# EAGLE design Rangkaian 3 (EAGLE 9.3.1)
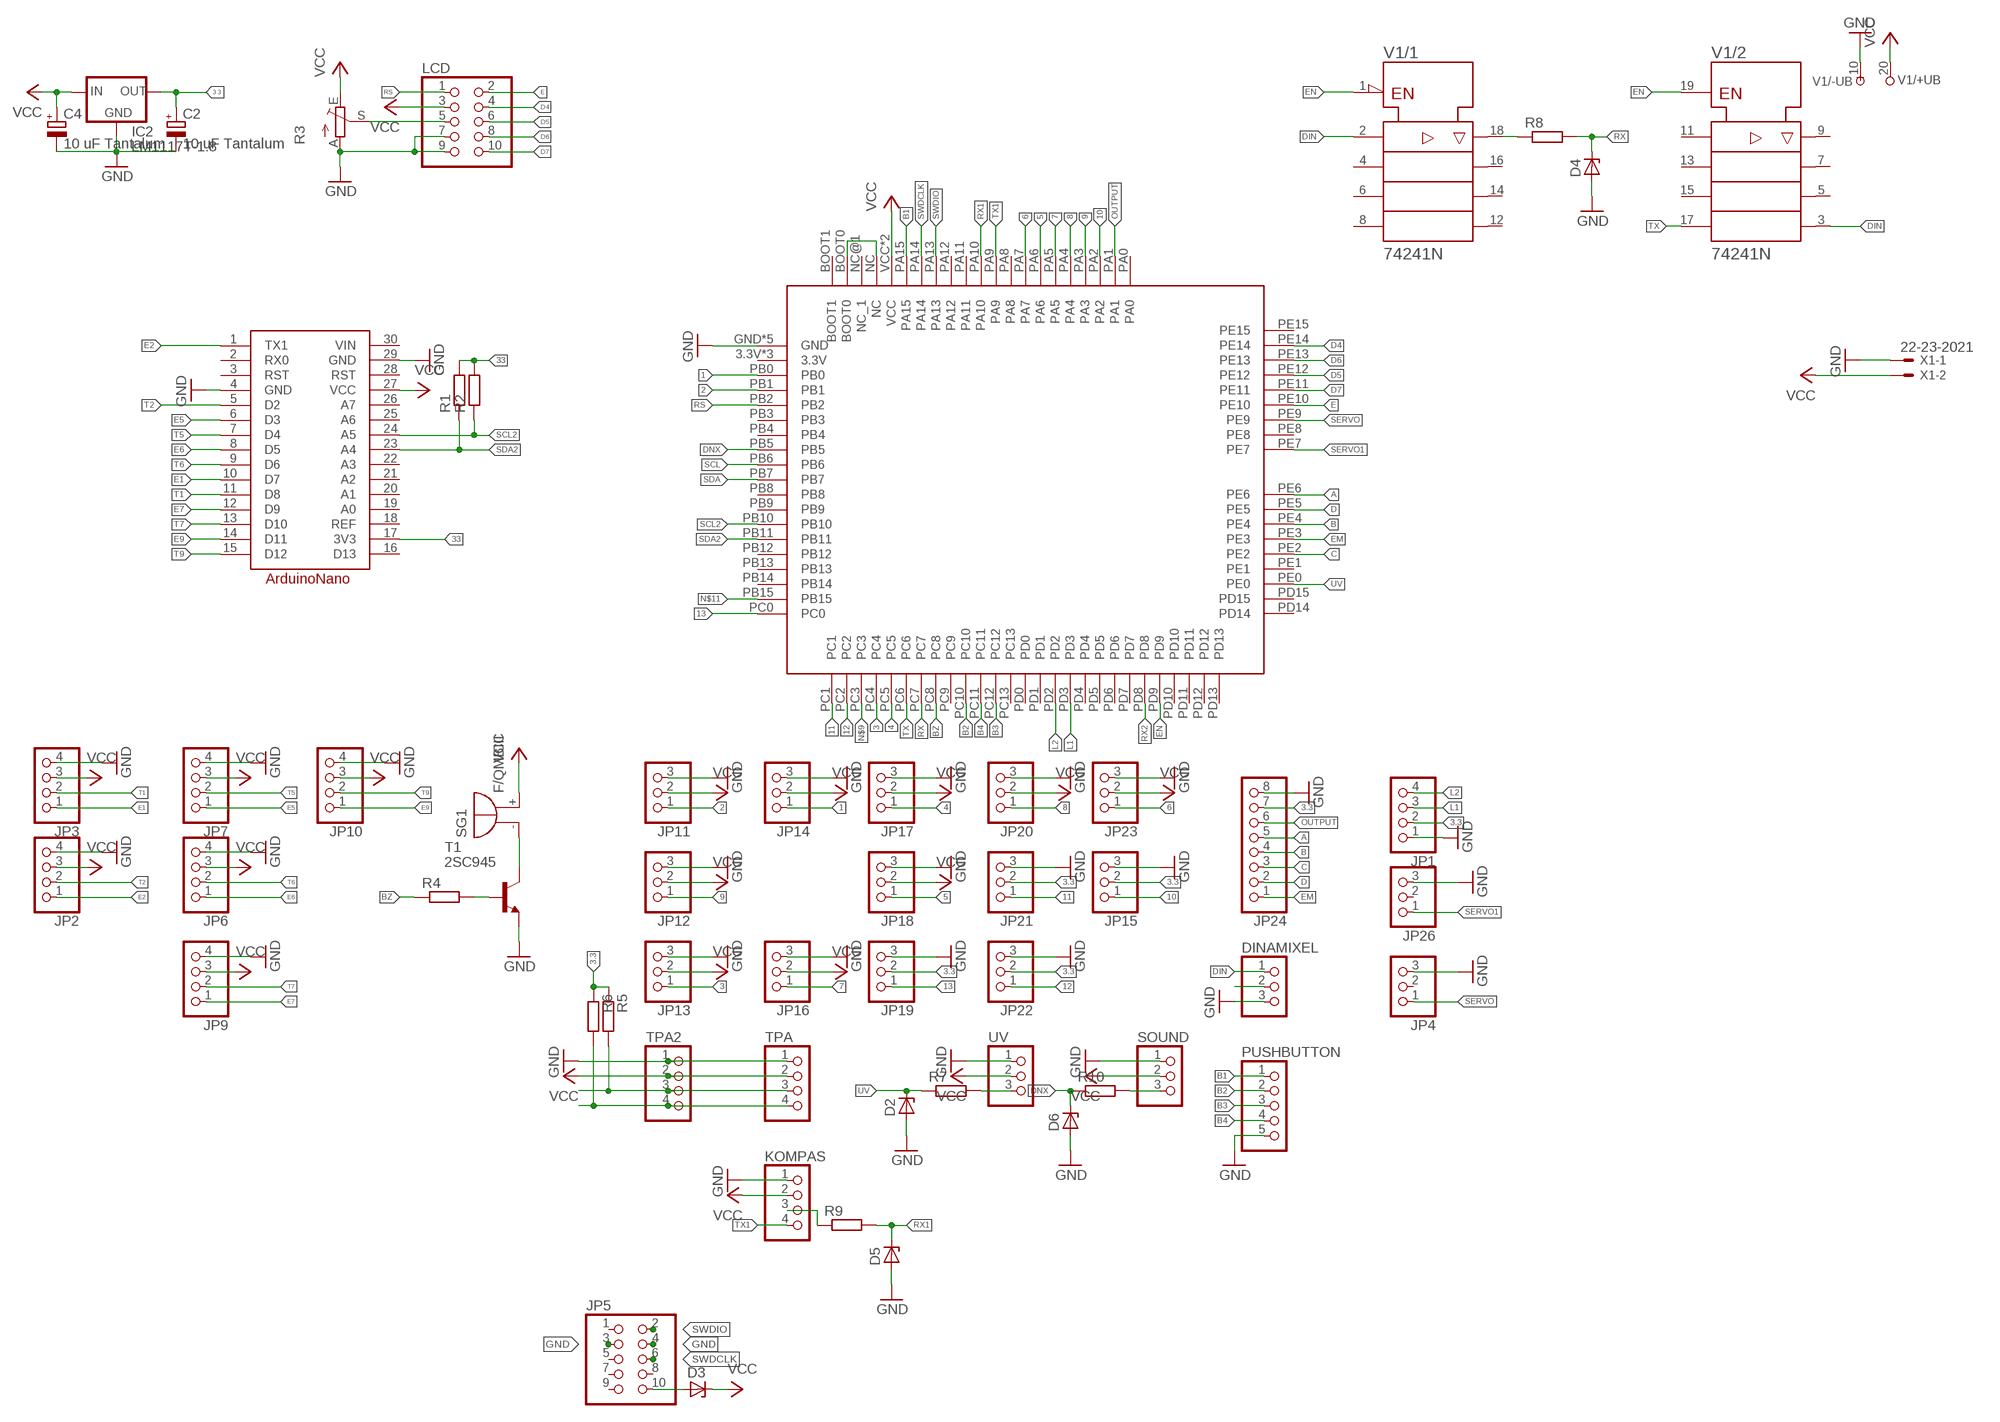
[diagram p0: schematic, sheet 1]

## Parts
A1  ARDUINONANO  [ARDUINONANO]
C2  10 uF Tantalum  CPOL-EUE2.5-5  [E2,5-5]
C4  10 uF Tantalum  CPOL-EUE2.5-5  [E2,5-5]
D2  ZENER-DIODEDO34-7  [DO34Z7]
D3  ZENER-DIODEDO34-7  [DO34Z7]
D4  ZENER-DIODEDO34-7  [DO34Z7]
D5  ZENER-DIODEDO34-7  [DO34Z7]
D6  ZENER-DIODEDO34-7  [DO34Z7]
DINAMIXEL  PINHD-1X3  [1X03]
IC2  LM1117T-1.8  [TO220]
JP1  PINHD-1X4  [1X04]
JP2  PINHD-1X4  [1X04]
JP3  PINHD-1X4  [1X04]
JP4  PINHD-1X3  [1X03]
JP5  PINHD-2X5  [2X05]
JP6  PINHD-1X4  [1X04]
JP7  PINHD-1X4  [1X04]
JP9  PINHD-1X4  [1X04]
JP10  PINHD-1X4  [1X04]
JP11  PINHD-1X3  [1X03]
JP12  PINHD-1X3  [1X03]
JP13  PINHD-1X3  [1X03]
JP14  PINHD-1X3  [1X03]
JP15  PINHD-1X3  [1X03]
JP16  PINHD-1X3  [1X03]
JP17  PINHD-1X3  [1X03]
JP18  PINHD-1X3  [1X03]
JP19  PINHD-1X3  [1X03]
JP20  PINHD-1X3  [1X03]
JP21  PINHD-1X3  [1X03]
JP22  PINHD-1X3  [1X03]
JP23  PINHD-1X3  [1X03]
JP24  PINHD-1X8  [1X08]
JP26  PINHD-1X3  [1X03]
KOMPAS  PINHD-1X4  [1X04]
LCD  PINHD-2X5  [2X05]
PUSHBUTTON  PINHD-1X5  [1X05]
R1  R-EU_0204/7  [0204/7]
R2  R-EU_0204/7  [0204/7]
R3  TRIM_EU-CA6V  [CA6V]
R4  R-EU_0204/7  [0204/7]
R5  R-EU_0204/7  [0204/7]
R6  R-EU_0204/7  [0204/7]
R7  R-EU_0204/7  [0204/7]
R8  R-EU_0204/7  [0204/7]
R9  R-EU_0204/7  [0204/7]
R10  R-EU_0204/7  [0204/7]
SG1  F/QMBIII  [F/QMBIII]
SOUND  PINHD-1X3  [1X03]
T1  2SC945  [TO92-ECB]
TPA  PINHD-1X4  [1X04]
TPA2  PINHD-1X4  [1X04]
U$1  STM32F4  [STM32F4]
UV  PINHD-1X3  [1X03]
V1  74241N  [DIL20]
X1  22-23-2021  [22-23-2021]

## Nets
1: JP14.1 U$1.PB0
2: JP11.1 U$1.PB1
3: JP13.1 U$1.PC4
3.3: C2.+ IC2.2(OUT) JP1.2 JP15.2 JP19.2 JP21.2 JP22.2 JP24.7 R5.1 R6.1
4: JP17.1 U$1.PC5
5: JP18.1 U$1.PA6
6: JP23.1 U$1.PA7
7: JP16.1 U$1.PA5
8: JP20.1 U$1.PA4
9: JP12.1 U$1.PA3
10: JP15.1 U$1.PA2
11: JP21.1 U$1.PC1
12: JP22.1 U$1.PC2
13: JP19.1 U$1.PC0
33: A1.17(3V3) R1.2 R2.2
A: JP24.5 U$1.PE6
B: JP24.4 U$1.PE4
B1: PUSHBUTTON.1 U$1.PA15
B2: PUSHBUTTON.2 U$1.PC10
B3: PUSHBUTTON.3 U$1.PC12
B4: PUSHBUTTON.4 U$1.PC11
BZ: R4.1 U$1.PC8
C: JP24.3 U$1.PE2
D: JP24.2 U$1.PE5
D4: LCD.4 U$1.PE14
D5: LCD.6 U$1.PE12
D6: LCD.8 U$1.PE13
D7: LCD.10 U$1.PE11
DIN: DINAMIXEL.1 V1.2(/1:A1) V1.3(/2:Y4)
DNX: D6.C R10.1 U$1.PB5
E: LCD.2 U$1.PE10
E1: A1.10(D7) JP3.1
E2: A1.1(TX1) JP2.1
E5: A1.6(D3) JP7.1
E6: A1.8(D5) JP6.1
E7: A1.12(D9) JP9.1
E9: A1.14(D11) JP10.1
EM: JP24.1 U$1.PE3
EN: U$1.PD9 V1.1(/1:!G) V1.19(/2:G)
GND: A1.4(GND) A1.29(GND) C2.- C4.- D2.A D4.A D5.A D6.A DINAMIXEL.3 IC2.1(GND) JP1.1 JP2.4 JP3.4 JP4.3 JP5.3 JP5.4 JP6.4 JP7.4 JP9.4 JP10.4 JP11.3 JP12.3 JP13.3 JP14.3 JP15.3 JP16.3 JP17.3 JP18.3 JP19.3 JP20.3 JP21.3 JP22.3 JP23.3 JP24.8 JP26.3 KOMPAS.1 LCD.7 LCD.9 PUSHBUTTON.5 R3.A SOUND.1 T1.E TPA2.1 TPA.1 U$1.GND U$1.GND@1(GND) U$1.GND@2(GND) U$1.GND@3(GND) U$1.GND@5(GND) UV.1 V1.10(/-UB:-UB) X1.1
L1: JP1.3 U$1.PD3
L2: JP1.4 U$1.PD2
N$1: D3.A JP5.10
N$5: KOMPAS.3 R9.1
N$6: R7.2 UV.3
N$7: LCD.5 R3.S
N$8: DINAMIXEL.2
N$9: U$1.PC3
N$10: R8.1 V1.18(/1:Y1)
N$11: U$1.PB15
N$12: R10.2 SOUND.3
N$15: U$1.BOOT0 U$1.NC
N$16: SG1.-(+) T1.C
N$17: R4.2 T1.B
OUTPUT: JP24.6 U$1.PA1
RS: LCD.1 U$1.PB2
RX: D4.C R8.2 U$1.PC7
RX1: D5.C R9.2 U$1.PA10
RX2: U$1.PD8
SCL: R6.2 TPA2.4 TPA.4 U$1.PB6
SCL2: A1.24(A5) R2.1 U$1.PB10
SDA: R5.2 TPA2.3 TPA.3 U$1.PB7
SDA2: A1.23(A4) R1.1 U$1.PB11
SERVO: JP4.1 U$1.PE9
SERVO1: JP26.1 U$1.PE7
SWDCLK: JP5.6 U$1.PA14
SWDIO: JP5.2 U$1.PA13
T1: A1.11(D8) JP3.2
T2: A1.5(D2) JP2.2
T5: A1.7(D4) JP7.2
T6: A1.9(D6) JP6.2
T7: A1.13(D10) JP9.2
T9: A1.15(D12) JP10.2
TX: U$1.PC6 V1.17(/2:A4)
TX1: KOMPAS.4 U$1.PA9
UV: D2.C R7.1 U$1.PE0
VCC: A1.27(VCC) C4.+ D3.C IC2.3(IN) JP2.3 JP3.3 JP6.3 JP7.3 JP9.3 JP10.3 JP11.2 JP12.2 JP13.2 JP14.2 JP16.2 JP17.2 JP18.2 JP20.2 JP23.2 KOMPAS.2 LCD.3 R3.E SG1.+(-) SOUND.2 TPA2.2 TPA.2 U$1.VCC U$1.VCC@1(VCC) UV.2 V1.20(/+UB:+UB) X1.2
Unconnected: A1.2(RX0) A1.3(RST) A1.16(D13) A1.19(A0) A1.20(A1) A1.21(A2) A1.22(A3) A1.25(A6) A1.26(A7) A1.28(RST) JP4.2 JP5.1 JP5.5 JP5.7 JP5.8 JP5.9 JP26.2 U$1.3.3V U$1.3.3V@2(3.3V) U$1.3.3V@3(3.3V) U$1.BOOT1 U$1.NC@1(NC_1) U$1.PA0 U$1.PA8 U$1.PA11 U$1.PA12 U$1.PB3 U$1.PB4 U$1.PB8 U$1.PB9 U$1.PB12 U$1.PB13 U$1.PB14 U$1.PC9 U$1.PC13 U$1.PD0 U$1.PD1 U$1.PD4 U$1.PD5 U$1.PD6 U$1.PD7 U$1.PD10 U$1.PD11 U$1.PD12 U$1.PD13 U$1.PD14 U$1.PD15 U$1.PE1 U$1.PE8 U$1.PE15 V1.4(/1:A2) V1.5(/2:Y3) V1.6(/1:A3) V1.7(/2:Y2) V1.8(/1:A4) V1.9(/2:Y1) V1.11(/2:A1) V1.12(/1:Y4) V1.13(/2:A2) V1.14(/1:Y3) V1.15(/2:A3) V1.16(/1:Y2)

## Power pins joined to a net without a drawn wire
REF: A1.18(REF)
VIN: A1.30(VIN)

## Library data of the parts
A1 = ArduinoNano:ARDUINONANO
C2 C4 = rcl:CPOL-EU: POLARIZED CAPACITOR, European symbol
D2-D6 = diode:ZENER-DIODE: Z-Diode
DINAMIXEL JP4 JP11-JP23 JP26 SOUND UV = pinhead:PINHD-1X3: PIN HEADER
IC2 = lm1117:LM1117T-*
JP1-JP3 JP6 JP7 JP9 JP10 KOMPAS TPA TPA2 = pinhead:PINHD-1X4: PIN HEADER
JP5 LCD = pinhead:PINHD-2X5: PIN HEADER
JP24 = pinhead:PINHD-1X8: PIN HEADER
PUSHBUTTON = pinhead:PINHD-1X5: PIN HEADER
R1 R2 R4-R10 = rcl:R-EU_: RESISTOR, European symbol
R3 = pot:TRIM_EU-: POTENTIOMETER
SG1 = buzzer:F/QMBIII: BUZZER Source: Buerklin; OC_FARNELL: unknown; OC_NEWARK: unknown
T1 = transistor:2SC945: NPN Silicon Epitaxial Planar Transistor Source: SEMTECH ELECTRONICS LTD. ... 2SC945 2.pdf
U$1 = STM32F407-2:STM32F4
V1 = 74ttl-din:74*241: Octal BUFFER and LINE DRIVER, 3-state
X1 = con-molex:22-23-2021: .100" (2.54mm) Center Header - 2 Pin; MF: MOLEX; MPN: 22-23-2021; OC_FARNELL: 1462926; OC_NEWARK: 25C3832

## Board
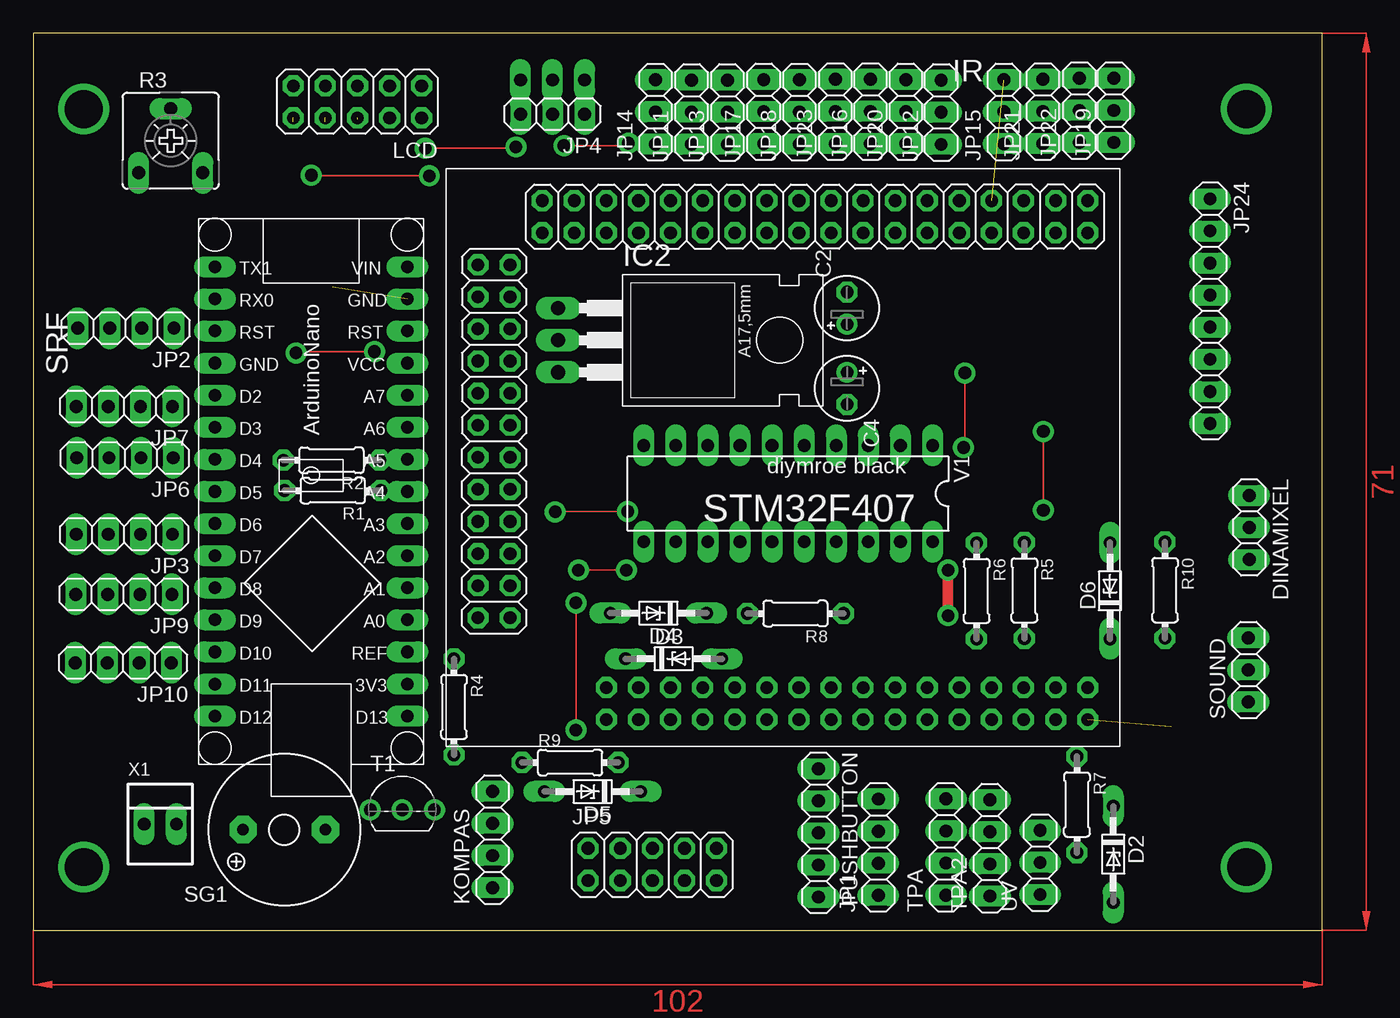
[diagram p1: board, top side]
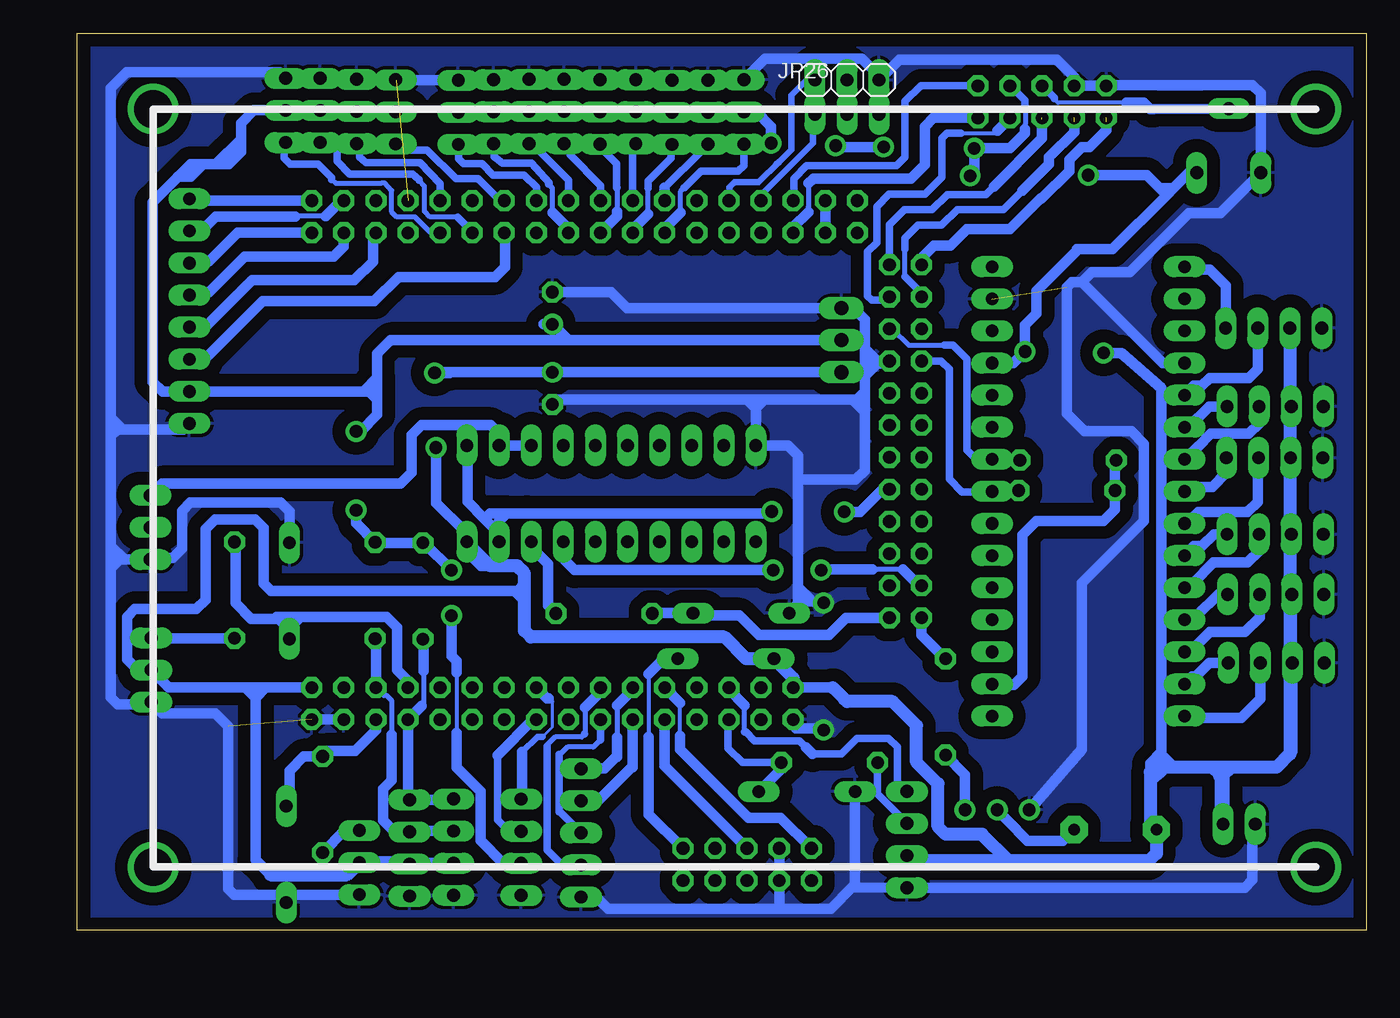
[diagram p2: board, bottom side, seen from below]

Size 102 x 71 mm. Coordinates in mm from the lower left corner, seen from the top.
Outline: 0,0 102,0 102,71 0,71 0,0
Copper layers (1*16): Top 0.035mm / dielectric 1.5mm / Bottom 0.035mm
Design rules "default *": minimum track width 6mil, minimum drill 1mm, track to track 6mil, track to pad 7mil, pad to pad 6mil, via to via 6mil, smd to smd 6mil, copper to edge 40mil, drill to drill 6mil, minimum pad ring 13mil, minimum via ring 13mil, stop-mask expansion 4mil, vias tented up to drill 0mil, thermal gap 10mil

### Footprints (pad centres in the part's own frame; a part is rotated, then mirrored left to right if it is on the bottom)
ARDUINONANO = drill 1 pad 1.575 long: 1 -7.62,16.51; 2 -7.62,13.97; 3 -7.62,11.43; 4 -7.62,8.89; 5 -7.62,6.35; 6 -7.62,3.81; 7 -7.62,1.27; 8 -7.62,-1.27; 9 -7.62,-3.81; 10 -7.62,-6.35; 11 -7.62,-8.89; 12 -7.62,-11.43; 13 -7.62,-13.97; 14 -7.62,-16.51; 15 -7.62,-19.05; 16 7.62,-19.05; 17 7.62,-16.51; 18 7.62,-13.97; 19 7.62,-11.43; 20 7.62,-8.89; 21 7.62,-6.35; 22 7.62,-3.81; 23 7.62,-1.27; 24 7.62,1.27; 25 7.62,3.81; 26 7.62,6.35; 27 7.62,8.89; 28 7.62,11.43; 29 7.62,13.97; 30 7.62,16.51
E2,5-5 = drill 1 pad 1.6: + -1.27,0 | drill 1 pad 1.6 octagon: - 1.27,0
DO34Z7 = drill 1 long: A 3.81,0; C -3.81,0
1X03 = drill 1.016 long: 1 -2.54,0; 2 0,0; 3 2.54,0
TO220 = drill 1.118 long: 1 -2.54,-6.35; 2 0,-6.35; 3 2.54,-6.35
1X04 = drill 1.016 long: 1 -3.81,0; 2 -1.27,0; 3 1.27,0; 4 3.81,0
2X05 = drill 1.016 octagon: 1 -5.08,-1.27; 2 -5.08,1.27; 3 -2.54,-1.27; 4 -2.54,1.27; 5 0,-1.27; 6 0,1.27; 7 2.54,-1.27; 8 2.54,1.27; 9 5.08,-1.27; 10 5.08,1.27
1X08 = drill 1.016 long: 1 -8.89,0; 2 -6.35,0; 3 -3.81,0; 4 -1.27,0; 5 1.27,0; 6 3.81,0; 7 6.35,0; 8 8.89,0
2X05' = drill 1 octagon: 1 -5.08,-1.27; 2 -5.08,1.27; 3 -2.54,-1.27; 4 -2.54,1.27; 5 0,-1.27; 6 0,1.27; 7 2.54,-1.27; 8 2.54,1.27; 9 5.08,-1.27; 10 5.08,1.27
1X05 = drill 1.016 long: 1 -5.08,0; 2 -2.54,0; 3 0,0; 4 2.54,0; 5 5.08,0
0204/7 = drill 1 octagon: 1 -3.81,0; 2 3.81,0
CA6V = drill 1.016 long: A -2.54,-2.54; E 2.54,-2.54; S 0,2.54
F/QMBIII = drill 0.914 pad 2.159 octagon: + 3.251,0; - -3.251,0
TO92-ECB = drill 1: B 2.54,0; C 0,0; E -2.54,0
STM32F4 = drill 1 octagon: 3.3V 13.97,-16.95; 3.3V@2 -29.21,6.35; 3.3V@3 8.89,19.05; BOOT0 -24.13,21.59; BOOT1 -26.67,21.59; GND 16.51,-19.49; GND@1 13.97,-19.49; GND@2 -21.59,-19.49; GND@3 -29.21,8.89; GND@5 8.89,21.59; NC -24.13,19.05; NC@1 -26.67,19.05; PA0 3.81,21.59; PA1 1.27,19.05; PA2 1.27,21.59; PA3 -1.27,21.59; PA4 -3.81,19.05; PA5 -3.81,21.59; PA6 -6.35,19.05; PA7 -6.35,21.59; PA8 -19.05,-19.49; PA9 -16.51,-16.95; PA10 -16.51,-19.49; PA11 -13.97,-16.95; PA12 -13.97,-19.49; PA13 -11.43,-16.95; PA14 -11.43,-19.49; PA15 -8.89,-16.95; PB0 -11.43,19.05; PB1 -11.43,21.59; PB2 -21.59,21.59; PB3 6.35,-16.95; PB4 6.35,-19.49; PB5 8.89,-16.95; PB6 8.89,-19.49; PB7 11.43,-16.95; PB8 -13.97,19.05; PB9 -13.97,21.59; PB10 -29.21,11.43; PB11 -31.75,8.89; PB12 -31.75,6.35; PB13 -29.21,3.81; PB14 -31.75,3.81; PB15 -29.21,1.27; PC0 6.35,19.05; PC1 6.35,21.59; PC2 3.81,19.05; PC3 -1.27,19.05; PC4 -8.89,19.05; PC5 -8.89,21.59; PC6 -31.75,-8.89; PC7 -29.21,-11.43; PC8 -31.75,-11.43; PC9 -19.05,-16.95; PC10 -8.89,-19.49; PC11 -6.35,-16.95; PC12 -6.35,-19.49; PC13 11.43,21.59; PD0 -3.81,-16.95; PD1 -3.81,-19.49; PD2 -1.27,-16.95; PD3 -1.27,-19.49; PD4 1.27,-16.95; PD5 1.27,-19.49; PD6 3.81,-16.95; PD7 3.81,-19.49; PD8 -31.75,1.27; PD9 -29.21,-1.27; PD10 -31.75,-1.27; PD11 -29.21,-3.81; PD12 -31.75,-3.81; PD13 -29.21,-6.35; PD14 -31.75,-6.35; PD15 -29.21,-8.89; PE0 11.43,-19.49; PE1 -16.51,19.05; PE2 16.51,19.05; PE3 16.51,21.59; PE4 13.97,19.05; PE5 13.97,21.59; PE6 11.43,19.05; PE7 -16.51,21.59; PE8 -19.05,19.05; PE9 -19.05,21.59; PE10 -21.59,19.05; PE11 -31.75,16.51; PE12 -29.21,16.51; PE13 -31.75,13.97; PE14 -29.21,13.97; PE15 -31.75,11.43; VCC 16.51,-16.95; VCC@1 -21.59,-16.95
DIL20 = drill 1 long: 1 -11.43,-3.81; 2 -8.89,-3.81; 3 -6.35,-3.81; 4 -3.81,-3.81; 5 -1.27,-3.81; 6 1.27,-3.81; 7 3.81,-3.81; 8 6.35,-3.81; 9 8.89,-3.81; 10 11.43,-3.81; 11 11.43,3.81; 12 8.89,3.81; 13 6.35,3.81; 14 3.81,3.81; 15 1.27,3.81; 16 -1.27,3.81; 17 -3.81,3.81; 18 -6.35,3.81; 19 -8.89,3.81; 20 -11.43,3.81
22-23-2021 = drill 1 long: 1 -1.27,0; 2 1.27,0

### Placement (x,y rotation side)
A1  22,36 0 top
C2  64.41,49.24 90 top
C4  64.41,42.89 270 top
D2  85.48,6.01 270 top
D3  50.69,21.49 0 top
D4  49.47,25.1 180 top
D5  44.27,10.98 180 top
D6  85.22,26.87 90 top
DINAMIXEL  96.23,31.88 270 top
IC2  47.9,46.7 270 top
JP1  66.88,6.57 90 top
JP2  7.32,47.65 180 top
JP3  7.21,31.34 180 top
JP4  41.1,64.6 180 top
JP5  49,5.2 0 top
JP6  7.26,37.39 180 top
JP7  7.21,41.46 180 top
JP9  7.17,26.59 180 top
JP10  7.12,21.17 180 top
JP11  52.1,64.75 90 top
JP12  71.86,64.74 90 top
JP13  54.94,64.74 90 top
JP14  49.26,64.77 90 top
JP15  76.82,64.78 90 top
JP16  66.26,64.81 90 top
JP17  57.81,64.79 90 top
JP18  60.63,64.77 90 top
JP19  85.53,64.89 90 top
JP20  69.06,64.79 90 top
JP21  79.91,64.81 90 top
JP22  82.79,64.89 90 top
JP23  63.48,64.81 90 top
JP24  93.14,49 270 top
JP26  41.1,67.3 0 bottom
KOMPAS  36.35,7.18 90 top
LCD  [2X05']  25.66,65.57 180 top
PUSHBUTTON  62.14,7.7 270 top
R1  23.7,34.8 180 top
R2  23.6,37.2 180 top
R3  10.88,62.49 0 top
R4  33.3,17.67 270 top
R5  78.44,26.9 270 top
R6  74.66,26.86 270 top
R7  82.6,9.95 270 top
R8  60.32,25.07 180 top
R9  42.49,13.27 0 top
R10  89.57,26.92 270 top
SG1  19.86,7.96 180 top
SOUND  96.17,20.6 90 top
T1  29.21,9.53 0 top
TPA  72.24,6.58 90 top
TPA2  75.71,6.51 90 top
U$1  66.95,36.16 0 top
UV  79.69,5.36 90 top
V1  59.74,34.56 180 top
X1  10.05,8.4 0 top

### Tracks (layer width: path | path; a pad name or v marks a point on that pad's centre or on a via)
1
  Bottom 0.406: 54.27,56.79 54.27,58.49 53.98,58.78
  Bottom 0.61: 53.98,58.78 53.96,58.78 52.67,60.07 49.72,60.07 49.26,60.53 JP14.1
  Bottom 0.813: U$1.PB0 55.52,55.54 54.27,56.79
2
  Bottom 0.61: 55.52,58.77 52.57,61.72 52.57,61.74 JP11.1
  Bottom 0.813: U$1.PB1 55.52,58.77
3
  Bottom 0.406: 56.84,56.69 56.84,58.75
  Bottom 0.61: 56.84,58.75 56.84,59.3 55.04,61.1 55.04,62.1 JP13.1
  Bottom 0.813: U$1.PC4 58.06,55.47 56.84,56.69
3.3  (via drill 1)
  Top 0.127: v79.95,39.49 v79.95,33.25
  Top 0.813: v72.4,28.5 v72.4,24.9
  Bottom 0.305: 72,20.4 72,15.6
  Bottom 0.813: JP15.2 79.88,64.78 JP21.2 82.71,64.81 JP22.2 JP19.2 88.05,64.89 89.05,63.89 89.05,62.63 | IC2.2 63.14,46.7 | 63.14,46.7 C2.+ 65.1,47.97 | 79.35,42.65 JP24.7 93.17,42.62 95.27,42.62 96.05,43.4 96.05,57.63 93.05,60.63 92.05,60.63 | 79.35,42.65 78.92,42.65 78.39,42.12 | v79.95,33.25 79.95,32.22 R5.1 78.4,30.67 R6.1 74.57,30.67 v72.4,28.5 | 63.14,46.7 77.2,46.7 78.27,45.63 78.27,43.73 | 78.27,43.73 78.27,40.8 79.58,39.49 v79.95,39.49 | 79.35,42.65 78.27,43.73 | 91.05,60.63 90.05,60.63 89.05,61.63 89.05,62.63 | 92.05,60.63 91.05,60.63 | 91.05,60.63 89.05,62.63 | 94.05,59.63 93.05,59.63 92.05,60.63 | v72.4,24.9 72.4,21.7 72,21.3 72,20.4 | 72,15.6 72,12.9 70.1,11 70.1,7.1 68.3,5.3 JP1.2
4
  Bottom 0.61: U$1.PC5 58.06,62 JP17.1
5
  Bottom 0.406: 59.3,58.76 59.3,56.87
  Bottom 0.61: JP18.1 60.63,61.97 59.32,60.66 59.32,58.78 59.3,58.76
  Bottom 0.813: 59.3,56.87 59.3,56.51 U$1.PA6
6
  Bottom 0.61: U$1.PA7 60.6,58.95 63.03,61.38 63.03,61.82 JP23.1
7
  Bottom 0.61: U$1.PA5 63.14,59.35 65.8,62.01 66,62.01 JP16.1
8
  Bottom 0.406: 64.4,56.81 64.4,58.74 64.71,59.05
  Bottom 0.61: 64.71,59.05 64.68,59.17 66.07,60.7 68.36,60.7 69.04,61.24 69.04,62.23 JP20.1
  Bottom 0.813: U$1.PA4 63.14,55.55 64.4,56.81
9
  Bottom 0.61: U$1.PA3 65.68,58.8 66.66,59.78 69.09,59.78 69.98,60.67 71.45,60.67 71.85,61.07 JP12.1
10
  Bottom 0.61: U$1.PA2 68.57,57.75 70.29,59.47 72.04,59.47 74.31,61.74 76.32,61.74 JP15.1
11
  Bottom 0.61: U$1.PC1 73.3,59.08 74.9,60.76 79.17,60.76 79.67,61.18 79.67,62.03 JP21.1
12
  Bottom 0.406: 71.91,56.46 74.09,56.46 74.53,56.9 74.53,58.91 74.98,59.36
  Bottom 0.61: 70.76,55.31 71.91,56.46 | 74.98,59.36 74.98,59.39 75.46,59.85 80.46,59.85 81.46,60.87 81.46,61.99 81.85,62.38 82.76,62.38 JP22.1
  Bottom 0.813: U$1.PC2 70.76,55.31
13
  Bottom 0.406: U$1.PC0 74.04,55.21 75.29,56.46 76.74,56.46 77.13,56.85 77.13,58.55 77.65,59.12 77.99,59.12 77.99,59.1 81.53,59.1 81.88,59.42
  Bottom 0.61: 81.88,59.42 81.88,59.56 82.94,60.62 85.15,60.62 85.65,61.12 85.65,62.23 JP19.1
33
  Bottom 0.813: R2.2 19.89,37.1 R1.2 19.89,33.31 20.8,32.4 26.1,32.4 27.2,31.3 27.2,20.1 27.9,19.4 29.53,19.4 A1.17
A
  Bottom 0.813: JP24.5 91.88,47.73 88.17,51.44 80.1,51.44 78.62,52.92 78.62,54.97 U$1.PE6
B
  Bottom 0.813: U$1.PE4 80.92,54.12 81.74,53.3 88.78,53.3 91.59,50.49 92.92,50.49 JP24.4
B1
  Bottom 0.406: 59.31,17.78 59.31,15.27
  Bottom 0.813: U$1.PA15 58.06,19.03 59.31,17.78 | 59.31,15.27 59.31,13.71 59.39,13.71 60.3,12.8 62.12,12.8 PUSHBUTTON.1
B2
  Bottom 0.813: PUSHBUTTON.2 60.8,10.24 58.14,12.9 58.06,12.9 U$1.PC10
B3
  Bottom 0.406: 60.6,15.07 61.17,14.5 63.2,14.5 63.8,13.9 63.87,13.9
  Bottom 0.61: U$1.PC12 60.6,15.07 | 63.87,13.9 63.87,9.36 63.8,9.36 PUSHBUTTON.3
B4
  Bottom 0.406: 61.83,17.64 61.83,15.56 61.85,15.54 62.09,15.3 64.2,15.3 64.83,14.67 64.83,14.57
  Bottom 0.61: 61.85,15.54 61.86,15.54 | 64.83,14.57 64.83,6.35 63.64,5.16 PUSHBUTTON.4
  Bottom 0.813: U$1.PC11 60.6,18.87 61.83,17.64
BZ
  Bottom 0.813: U$1.PC8 35.2,23.38 R4.1
C
  Bottom 0.813: U$1.PE2 89.34,55.21 91.59,52.96 92.99,52.96 JP24.3
D
  Bottom 0.406: 82.35,56.52 84.77,56.52 84.79,56.5
  Bottom 0.813: U$1.PE5 81.12,57.75 82.35,56.52 | 84.79,56.5 91.05,56.5 92.06,55.49 93,55.49 JP24.2
D4
  Bottom 0.305: 32.1,63.1 29.4,63.1 29.2,63.3
  Bottom 0.61: U$1.PE14 38.01,49.86 39.13,49.86 39.46,50.19 39.46,53.7 38.74,54.42 38.74,57.28 37.76,58.26 34.92,58.26 33.59,59.59 33.59,62.68 33.17,63.1 32.1,63.1
  Bottom 0.813: 29.2,63.3 LCD.4
D5  (1 unrouted)
  Bottom 0.61: 37.74,52.7 U$1.PE12 37.74,55.85 36.57,57.02 34.36,57.02 33.16,58.22 30.12,58.22 29.48,58.86
  Bottom 0.813: 29.48,58.86 25.66,62.68 25.66,64.21
D6  (1 unrouted)
  Bottom 0.406: 36.5,51.72 36.5,53.92
  Bottom 0.61: 27.22,58.53 28.7,57.05 32.36,57.05 33.61,55.8 35.47,55.8 36.5,54.77 36.5,53.92 | U$1.PE13 35.2,50.42 36.5,51.72
  Bottom 0.813: 27.22,58.53 25.1,60.65 25.1,61.2 23.12,63.18 23.12,64
D7  (1 unrouted)
  Bottom 0.813: U$1.PE11 35.2,53.2 34.2,54.2 32.9,54.2 31.6,55.5 28.2,55.5 25.8,57.9 25.7,57.9 23.5,60.1 23.5,61 22.5,62 21.9,62 20.86,63.03 20.86,63.06 20.58,63.34 20.58,64
DIN
  Bottom 0.813: V1.3 V1.2 68.63,39.31 69.3,39.98 74.77,39.98 75.54,39.21 75.54,36.24 76.43,35.35 95.3,35.35 DINAMIXEL.1
DNX
  Bottom 0.813: 86.09,24.66 86.22,24.79 84.35,24.79 | 86.09,24.66 85.22,23.79 D6.C 85.22,23.92 84.35,24.79 | U$1.PB5 75.84,19.72 76.72,20.6 76.72,23.96 77.55,24.79 84.35,24.79 | 86.09,24.66 88.25,24.66 89.49,25.89 89.49,30.65 R10.1
E
  Bottom 0.406: 44.16,56.85 44.16,57.24 44.15,57.25 44.15,59.12
  Bottom 0.813: U$1.PE10 45.36,55.65 44.16,56.85 | 44.15,59.12 43.77,59.5 36.02,59.5 34.92,60.6 34.92,63.62 34.24,64.3 LCD.2
E1
  Bottom 0.813: JP3.1 12.06,31.34 13,30.4 13.63,30.4 A1.10
E2
  Bottom 0.813: JP2.1 11.13,51.03 12.4,52.3 14.17,52.3 A1.1
E5
  Bottom 0.813: JP7.1 12.44,41.46 14.09,39.81 A1.6
E6
  Bottom 0.813: JP6.1 11.07,36.23 12.2,35.1 14.01,35.1 A1.8
E7
  Bottom 0.813: JP9.1 11.71,26.59 13.4,24.9 14.05,24.9 A1.12
E9
  Bottom 0.813: JP10.1 12.43,21.17 13.5,20.1 13.77,20.1 A1.14
EM
  Bottom 0.813: U$1.PE3 93,57.75 JP24.1
EN  (via drill 1)
  Top 0.102: v47.04,33.14 41.34,33.14
  Top 0.813: 41.34,33.14 v41.31,33.11
  Bottom 0.813: 69.78,32.56 68.63,31.41 V1.19 68.63,32.41 68.05,32.99 | 69.78,32.56 71.14,33.92 71.14,38.34 V1.1 | 68.05,32.99 66.43,32.99 46.66,32.99 46.66,33.08 v47.04,33.14 | v41.31,33.11 40.07,33.11 38.28,34.9 U$1.PD9 | 68.05,32.99 69.35,32.99 69.78,32.56
GND  (via drill 1)  (3 unrouted)
  Top 0.127: v42.95,15.85 v42.95,25.91
  Bottom 0.61: D4.A 45.66,25.36 44.98,26.04 | v42.95,25.91 44.85,25.91
  Bottom 0.813: C2.- 59.79,50.51 58.52,49.24 IC2.1 40.6,49.24 39.69,48.33 39.69,46.05 | 39.69,46.05 39.69,45.45 | 39.69,45.45 39.09,44.85 37.94,44.85 U$1.GND@3 | 39.69,43.85 39.69,45.45 | 39.69,43.85 39.69,42.62 | 39.69,42.62 40.29,42.02 40.68,42.02 | 47.64,42.02 48.06,42.02 | 47.64,42.02 40.68,42.02 | 49.02,42.02 48.06,42.02 | 49.02,42.02 64.01,42.02 C4.- | U$1.GND@3 38.49,45.05 39.69,43.85 | U$1.GND@3 38.69,45.05 39.69,46.05 | 44.66,15.97 U$1.GND@2 45.51,16.52 | 52.02,42.02 51.06,42.02 | 43.23,15.97 44.66,15.97 | JP19.3 JP22.3 82.71,67.35 JP21.3 79.88,67.32 JP15.3 76.78,67.28 JP12.3 71.81,67.33 JP20.3 69.04,67.35 JP16.3 JP23.3 63.44,67.31 JP18.3 60.61,67.33 JP17.3 57.76,67.28 JP13.3 JP11.3 52.08,67.31 JP14.3 47.57,69 39.9,69 38.56,67.66 JP26.3 | 39.69,42.62 39.69,41.03 | 40.68,42.02 39.69,41.03 | 45.15,15.97 44.66,15.97 | 43.29,15.91 43.23,15.97 | 40.7,3.38 KOMPAS.1 9.63,3.37 9,4 9,8.18 X1.1 | 80,2.82 UV.1 | 80,2.82 84.86,2.82 | 84.86,2.82 D2.A | 84.86,2.82 89.59,2.82 90.06,3.29 90.06,16.12 91.12,17.18 95.29,17.18 95.99,17.88 | 95.99,17.88 SOUND.1 | D6.A 85.22,33.14 85.92,33.84 93.08,33.84 93.73,33.19 93.73,30.2 94.45,29.48 96.09,29.48 DINAMIXEL.3 98.28,29.34 | 98.28,29.34 98.65,29.34 99.36,28.63 | 99.36,28.63 99.36,18.41 98.83,17.88 95.99,17.88 | V1.10 48.39,38.45 | 99.36,30.42 99.36,28.63 | 99.36,30.42 99.36,39.1 | 99.36,39.1 98.83,39.63 98.41,39.63 | 98.41,39.63 93.62,39.63 JP24.8 | 98.28,29.34 99.36,30.42 | 43.23,15.97 43.07,15.97 v42.95,15.85 | 45.28,24.72 D4.A 44.85,25.91 44.98,26.04 44.98,35.43 | 44.98,26.97 44.77,26.97 44.05,26.25 | U$1.GND@1 U$1.GND | 99.36,39.1 99.36,40.58 | 85.7,67.6 JP19.3 | 98.41,39.63 99.36,40.58
  Bottom 0.813: V1.10 48.31,41.31 | 48.31,41.35 48.31,41.77 48.06,42.02 | 48.31,41.31 49.02,42.02 | 48.31,41.31 48.31,41.35 | 48.31,41.35 47.64,42.02 | 45.77,38.37 44.98,37.58 44.98,35.43 | 45.77,38.37 45.77,38.34 | 39.69,41.03 39.69,36.4 40.42,35.67 44.74,35.67 44.98,35.43 | 45.77,38.37 V1.10 | 79.82,3 80,2.82 | 43.2,16 43.23,15.97 | JP19.3 86,67.9 98.1,67.9 99.36,66.64 99.36,40.58 | JP4.3 JP26.3 | T1.E 22.5,14.3 22.5,27.5 17.6,32.4 17.6,38.5 18.6,39.5 22.3,39.5 23.7,40.9 23.7,50.9 23.3,51.3 22.5,51.3 | A1.4 16.09,44.89 22.5,51.3 | 22.5,51.3 21.7,52.1 18.7,52.1 14.05,56.75 11.54,56.75 R3.A 8.34,66.24 9,66.9 20.52,66.9 LCD.9 LCD.7 23.12,67.52 24.5,68.9 36.96,68.9 JP26.3 | PUSHBUTTON.5 60.92,2.62 60,1.7 46.5,1.7 | D5.A 40.46,3.62 40.7,3.38 | 40.7,3.38 42.38,1.7 46.5,1.7 | 46.5,1.7 46.46,1.74 JP5.3 JP5.4
  pour Bottom (isolate 1.016): 101,70 1,70 1,2 1,1 101,1
L1
  Bottom 0.61: 68.75,13.85 68.75,8.75 67.8,7.8
  Bottom 0.813: U$1.PD3 65.93,16.67 68.75,13.85 | 67.8,7.8 66.92,7.8 JP1.3
L2
  Bottom 0.254: 64.45,18.1 64.45,16.05 65.2,15.3
  Bottom 0.406: 64.71,18.36 64.45,18.1
  Bottom 0.508: 65.2,15.3 65.6,15.3 66.8,14.1
  Bottom 0.813: 64.71,18.36 64.83,18.36 U$1.PD2 | 66.8,14.1 66.8,10.46 JP1.4
N$1
  Bottom 0.305: 56.8,20.3 56.8,15.3
  Bottom 0.813: JP5.10 56.8,9.19 56.8,15.3 | D3.A 55.61,21.49 56.8,20.3
N$5
  Bottom 0.61: R9.1 38.68,10.78 KOMPAS.3
N$6
  Bottom 0.813: UV.3 80.84,7.9 R7.2
N$7
  Bottom 0.305: 19,65.5 24.4,65.5 24.7,65.8
  Bottom 0.61: 24.7,65.8 24.7,65.88 LCD.5
  Bottom 0.813: R3.S 16.84,64.97 17.07,64.97 17.6,65.5 19,65.5
N$10
  Bottom 0.813: V1.18 66.09,30.32 64.75,28.98 64.75,25.69 R8.1
N$12
  Bottom 0.813: R10.2 96.14,23.11 SOUND.3
N$13  (via drill 3)
  other vias: 4,65
N$14  (via drill 3)
  other vias: 96,65
N$15
  Bottom 0.813: U$1.BOOT0 U$1.NC
N$16
  Bottom 0.813: T1.C 27.11,7.37 26.81,7.07 24,7.07 SG1.-
N$17
  Bottom 0.813: R4.2 31.75,12.31 T1.B
N$18  (via drill 3)
  other vias: 4,5
N$19  (via drill 3)
  other vias: 96,5
OUTPUT
  Bottom 0.813: JP24.6 91.95,45.19 87.36,49.78 78.52,49.78 76.6,51.7 68.96,51.7 68.16,52.5 68.16,55.15 U$1.PA1
RS
  Bottom 0.61: U$1.PB2 45.3,57.81 45.3,59.5 44.3,60.5 37.2,60.5 36.5,61.2 36.5,65.6 35.26,66.84 LCD.1
RX
  Bottom 0.813: U$1.PC7 41.17,24.73 42.52,23.38 48.08,23.38 49.61,24.91 53.09,24.91 D4.C 56.48,25.1 R8.2
RX1
  Bottom 0.61: R9.2 49.37,13.27 50.5,14.4 50.5,16.61 U$1.PA10
  Bottom 0.813: R9.2 46.3,12.76 D5.C
SCL
  Bottom 0.406: 74.78,17.77 74.6,17.94 74.6,20.52
  Bottom 0.813: R6.2 74.6,22.39 74.6,20.52 | 74.78,17.77 75.84,16.7 U$1.PB6 75.84,10.45 TPA2.4 72.31,10.32 TPA.4
SCL2
  Bottom 0.406: U$1.PB10 37.49,47.59 36.2,46.3 33.4,46.3
  Bottom 0.61: 33.4,46.3 32.7,46.3 31.6,45.2 31.6,38 31.1,37.5 29.85,37.5 29.65,37.3
  Bottom 0.813: 29.65,37.3 A1.24 29.55,37.2 R2.1
SDA
  Bottom 0.406: 77.14,15.46 77.14,18.2 77.52,18.58 77.75,18.58 U$1.PB7
  Bottom 0.813: U$1.PB7 78.38,23.03 R5.2 | 77.14,15.46 77.14,11.86 77.8,11.2 77.8,8.7 77,7.9 76.32,7.9 76.3,7.88 TPA2.3 75.64,7.85 TPA.3
SDA2
  Bottom 0.61: U$1.PB11 33.65,45.05 33,44.4 33,35.7 32,34.7 29.65,34.7 A1.23
  Bottom 0.813: A1.23 27.58,34.73 R1.1
SERVO
  Bottom 0.508: U$1.PE9 47.9,58.2 43.8,62.3 43.8,64.44 JP4.1
SERVO1
  Bottom 0.508: JP26.1 44.3,67.3 45.5,66.1 45.5,61.8 46.45,60.85 | 46.45,60.85 46.7,60.6 | 46.45,60.85 48.1,59.2 50,59.2 50.4,58.8 50.4,57.79 U$1.PE7
SWDCLK
  Bottom 0.813: JP5.6 55.52,12.99 U$1.PA14
SWDIO
  Bottom 0.305: 54.3,15.4 54.3,18
  Bottom 0.61: 55.52,18.87 U$1.PA13
  Bottom 0.813: 55.59,19.21 U$1.PA13 54.3,18 | JP5.2 46.35,8.9 48.9,8.9 54.3,14.3 54.3,15.4
T1
  Bottom 0.813: JP3.2 8.48,30.02 9.4,29.1 12.1,29.1 13.7,27.5 13.99,27.5 A1.11
T2
  Bottom 0.813: JP2.2 8.59,44.41 9.3,43.7 12.4,43.7 13,43.1 13.63,43.1 A1.5
T5
  Bottom 0.813: JP7.2 8.48,40.12 9.3,39.3 12.3,39.3 13.3,38.3 13.35,38.3 A1.7
T6
  Bottom 0.813: A1.9 14.21,32.19 13.3,33.1 9.4,33.1 8.6,33.9 8.6,34.9 | 8.6,34.9 8.6,35.6 | 8.6,34.9 8.6,37.32 JP6.2
T7
  Bottom 0.813: JP9.2 8.44,24.76 9.6,23.6 12.4,23.6 13.7,22.3 14.11,22.3 A1.13
T9
  Bottom 0.813: JP10.2 8.39,18.31 9.9,16.8 14.23,16.8 A1.15
TX  (via drill 1)
  Top 0.127: v43.14,28.5 v46.94,28.5
  Bottom 0.406: 36.66,28.54 39.07,28.54
  Bottom 0.813: U$1.PC6 35.39,27.27 36.66,28.54 | 39.07,28.54 43.28,28.54 43.3,28.52 43.16,28.52 v43.14,28.5 | v46.94,28.5 62.64,28.5 63.4,29.26 63.4,30.6 V1.17
TX1
  Bottom 0.406: 49.2,17.81 49.2,15.7 49.16,15.66
  Bottom 0.61: 44.35,14.48 44.87,15 48.4,15 49.1,15.7 49.2,15.7 | 43.82,13.95 41.55,13.95 40.3,15.2 37.8,15.2 37.1,14.5 37.1,11.74 KOMPAS.4
  Bottom 0.813: U$1.PA9 50.44,19.05 49.2,17.81 | 44.35,14.48 43.82,13.95
UV
  Bottom 0.813: U$1.PE0 78.38,15.86 80.03,14.21 82.15,14.21 R7.1 84.08,13.76 85.21,12.63 85.21,10.09 D2.C
VCC  (via drill 1)
  Top 0.102: v31.35,59.72 22.04,59.72 | v27,45.8 20.9,45.8 | v31.02,61.89 38.09,61.89 | v42,62.1 46.9,62.1
  Top 0.127: v73.73,44.11 73.73,38.31 v73.63,38.21
  Top 0.813: 22.04,59.72 v22,59.76 | 20.9,45.8 v20.8,45.7 | 38.09,61.89 v38.2,62 | 46.9,62.1 v47.1,62.3
  Bottom 0.406: 27,65.2 27,64.81 26.99,64.8 26.99,63.8 27,63.79 27,63.4
  Bottom 0.61: LCD.3 28.14,66.84 27,65.7 27,65.2
  Bottom 0.813: IC2.3 C4.+ 72.5,44.16 | JP12.2 71.81,64.79 JP20.2 69.04,64.81 JP16.2 JP23.2 63.44,64.77 JP18.2 60.61,64.79 JP17.2 57.76,64.74 JP13.2 JP11.2 52.08,64.77 JP14.2 48.27,64.77 47.1,63.6 v47.1,62.3 | U$1.VCC 87.09,19.21 | 87.09,19.21 87.91,18.39 87.91,18.38 | 87.91,18.38 87.91,5.57 86.73,4.39 | 16.61,6.08 16.61,7.3 SG1.+ 17.1,8.45 17.1,11.8 | 88.74,19.21 87.09,19.21 | 88.74,19.21 94.78,19.21 SOUND.2 97.24,20.6 98.07,21.43 98.07,24.79 97.45,25.41 92.6,25.41 91.86,26.15 91.86,31.74 91.09,32.51 87.92,32.51 87.26,31.85 87.26,27.45 86.67,26.86 67.41,26.86 | 87.91,18.38 88.74,19.21 | 67.41,26.86 66.63,26.08 66.63,25.04 | 66.63,25.04 66.63,23.71 | 72.5,44.16 72.9,44.16 | 73.68,44.16 v73.73,44.11 72.55,44.11 72.5,44.16 | v73.63,38.21 73.63,33.83 71.46,31.66 71.46,30.52 71.43,30.49 V1.20 71.17,29.94 70.07,28.84 67.2,28.84 66.64,28.28 66.64,27.39 | 66.64,27.39 66.64,25.05 66.63,25.04 | 67.41,26.86 67.17,26.86 66.64,27.39 | A1.27 27.91,44.89 v27,45.8 27,47.9 26.1,48.8 26.1,50.6 22.9,53.8 22.9,53.9 20.1,53.9 15.8,58.2 | v31.35,59.72 31.02,60.05 v31.02,61.89 v31.01,61.9 28.2,61.9 27,63.1 27,63.4 | JP2.3 6.05,42.67 JP7.3 6.04,37.44 JP6.3 5.99,31.39 JP3.3 5.94,26.63 JP9.3 5.9,21.22 JP10.3 5.85,14.15 7.1,12.9 | 11.6,12 10.7,12.9 12.3,12.9 | 11.6,12 11.6,8.68 X1.2 | 17.1,11.8 17.1,12.5 17.1,13 | 15.2,12.9 12.3,12.9 | 15.2,12.9 16,12.9 | 16,12.9 17,12.9 17.1,13 | 16.2,12.5 16,12.9 | 16.2,12.5 17.1,11.8 | 11.6,12 11.6,12.2 12.3,12.9 | U$1.VCC@1 42.21,19.21 41.1,18.1 | v20.8,45.7 19.4,45.7 16.2,42.9 16.2,14.1 | 16.2,13.9 16.2,12.5 | 17.1,13 17.1,13.2 16.2,14.1 | 16.2,14.1 16.2,13.9 | 16.2,13.9 15.2,12.9
  Bottom 0.813: v38.2,62 41.9,62 v42,62.1 | R3.E 14.05,59.95 15.25,58.75 | 15.25,58.75 15.8,58.2 | 16.35,58.75 15.8,58.2 | 16.35,58.75 17.36,59.76 v22,59.76 | 15.25,58.75 16.35,58.75
  Bottom 1.016: JP2.3 6.05,13.95 7.1,12.9 10.7,12.9 | 10.7,12.9 10.9,12.9 | 10.9,12.9 11.6,12.2 | X1.2 11.32,12.28 10.7,12.9 | 10.9,12.9 16.7,12.9 17.1,12.5 17.1,7.79 16.61,7.3 | SG1.+ 16.61,6.08 17.2,5.49 28.3,5.49 | 41.3,18.3 42.21,19.21 | 70.8,30.3 69.34,28.84 67.2,28.84 66.63,28.27 66.63,23.71 66.12,23.2 50.8,23.2 49.09,21.49 D3.C 45.36,19.97 U$1.VCC@1 | 28.3,5.49 30.41,7.6 33.3,7.6 33.9,8.2 33.9,11.6 35.6,13.3 35.6,16.2 37.5,18.1 41.1,18.1 | 28.3,5.49 36.93,5.49 KOMPAS.2 | 86.73,4.39 80.66,4.39 UV.2 75.83,5.36 TPA2.2 72.31,5.24 TPA.2
(copper drawn outside any net)
  shapes: Top area x2

### Text on the board
tPlace: IR | SRF